# EAGLE design fusibili (EAGLE 4.14)
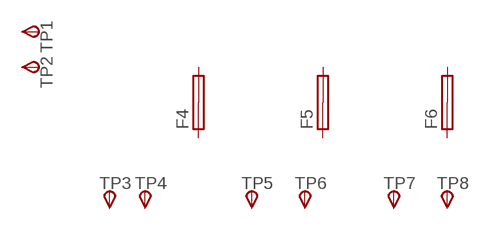
[diagram p0: schematic, sheet 1]

## Parts
F4  SHK20L  [SHK20L]
F5  SHK20L  [SHK20L]
F6  SHK20L  [SHK20L]
TP1  TPSPAD1-20Y  [P1-20Y]
TP2  TPSPAD1-20Y  [P1-20Y]
TP3  TPSPAD1-20Y  [P1-20Y]
TP4  TPSPAD1-20Y  [P1-20Y]
TP5  TPSPAD1-20Y  [P1-20Y]
TP6  TPSPAD1-20Y  [P1-20Y]
TP7  TPSPAD1-20Y  [P1-20Y]
TP8  TPSPAD1-20Y  [P1-20Y]
Unconnected: F4.1A F4.1B F4.2A F4.2B F5.1A F5.1B F5.2A F5.2B F6.1A F6.1B F6.2A F6.2B TP1.1(PP) TP2.1(PP) TP3.1(PP) TP4.1(PP) TP5.1(PP) TP6.1(PP) TP7.1(PP) TP8.1(PP)

## Library data of the parts
F4-F6 = fuse:SHK20L: FUSE HOLDER 5 x 20 mm, SH contact, SHH1 Schukat, E1073 Buerklin
TP1-TP8 = testpad:TPS: TEST PIN

## Board
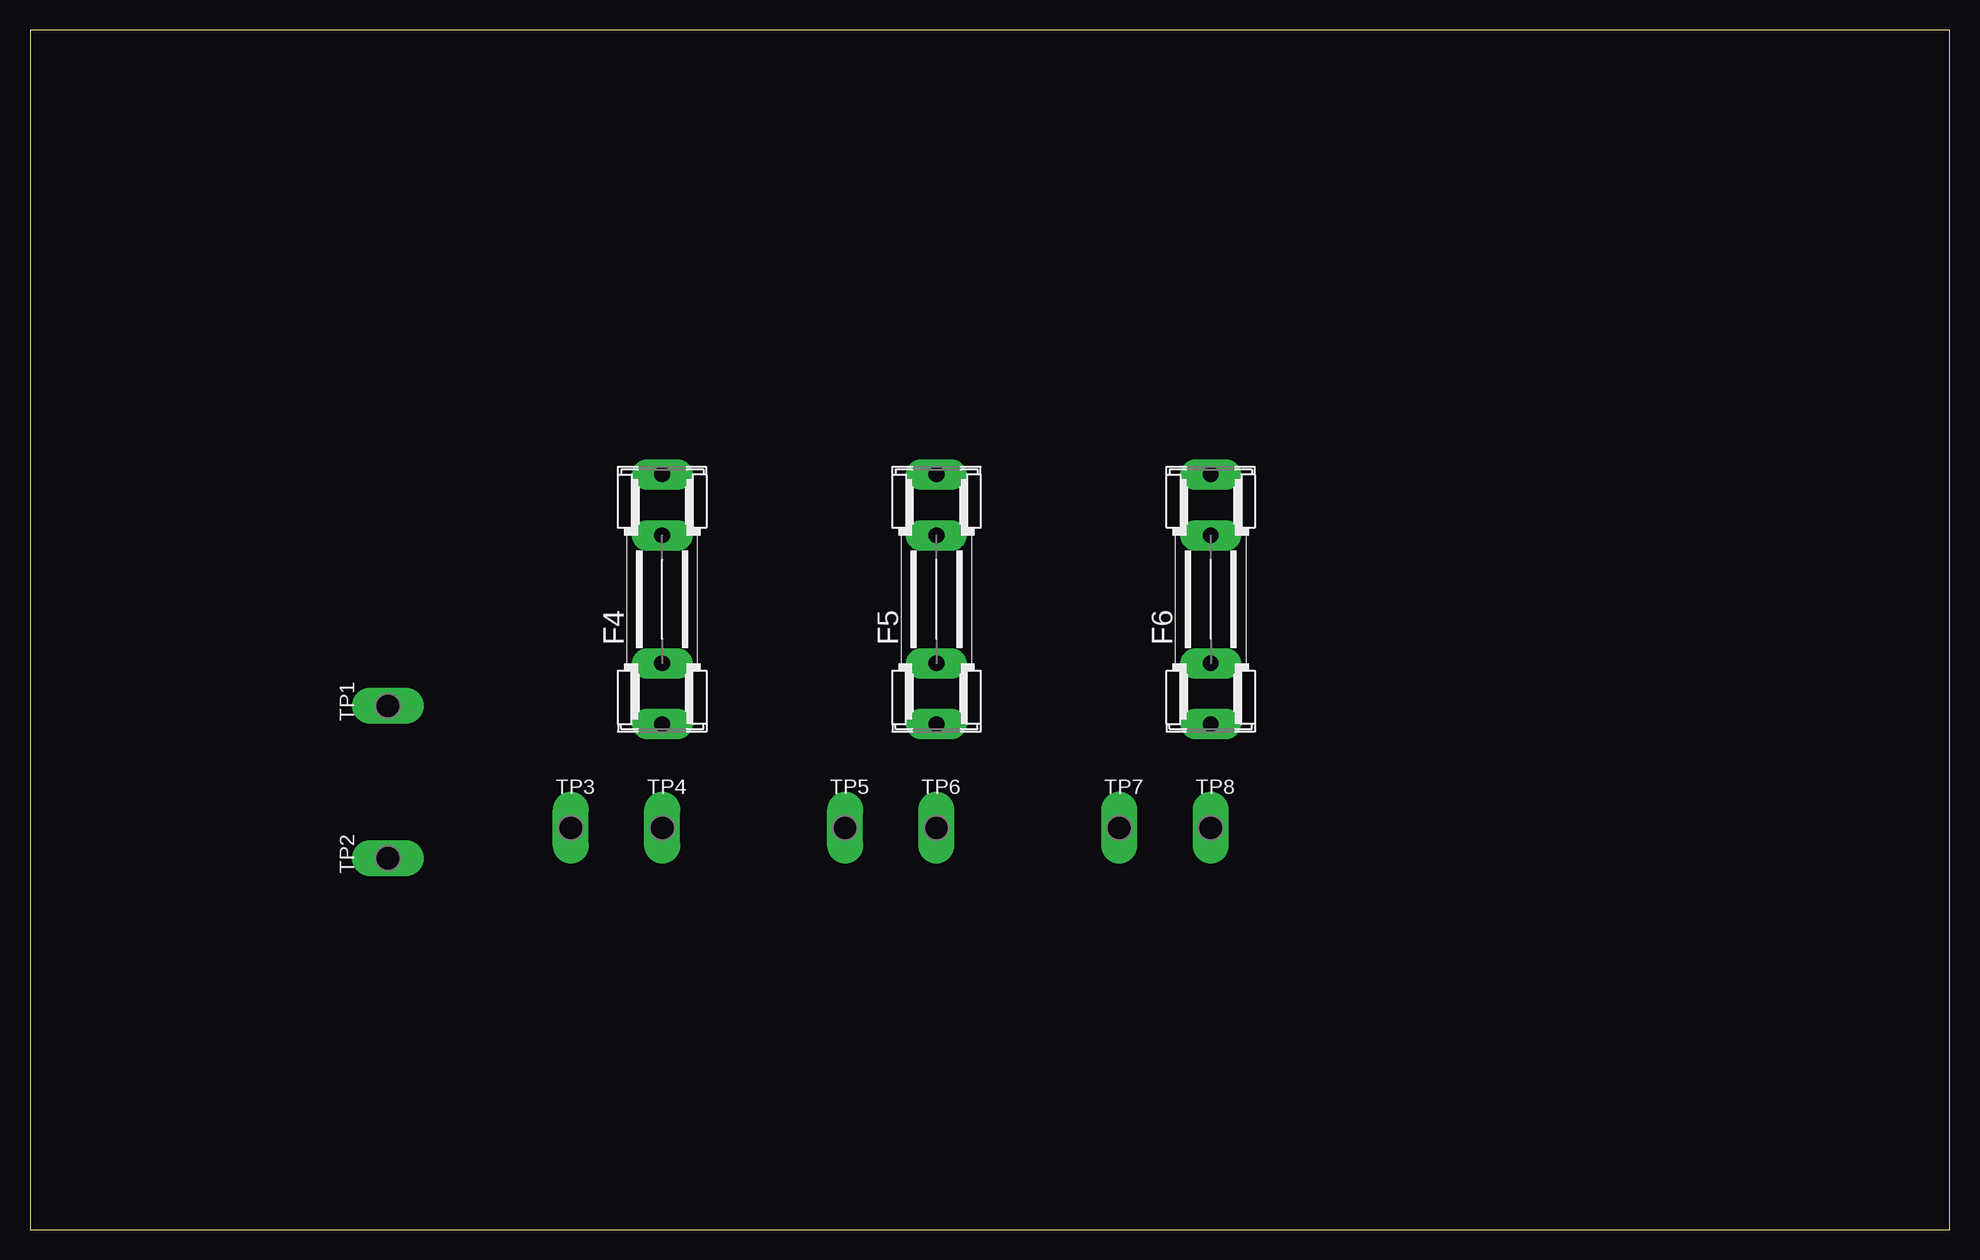
[diagram p1: board, top side]
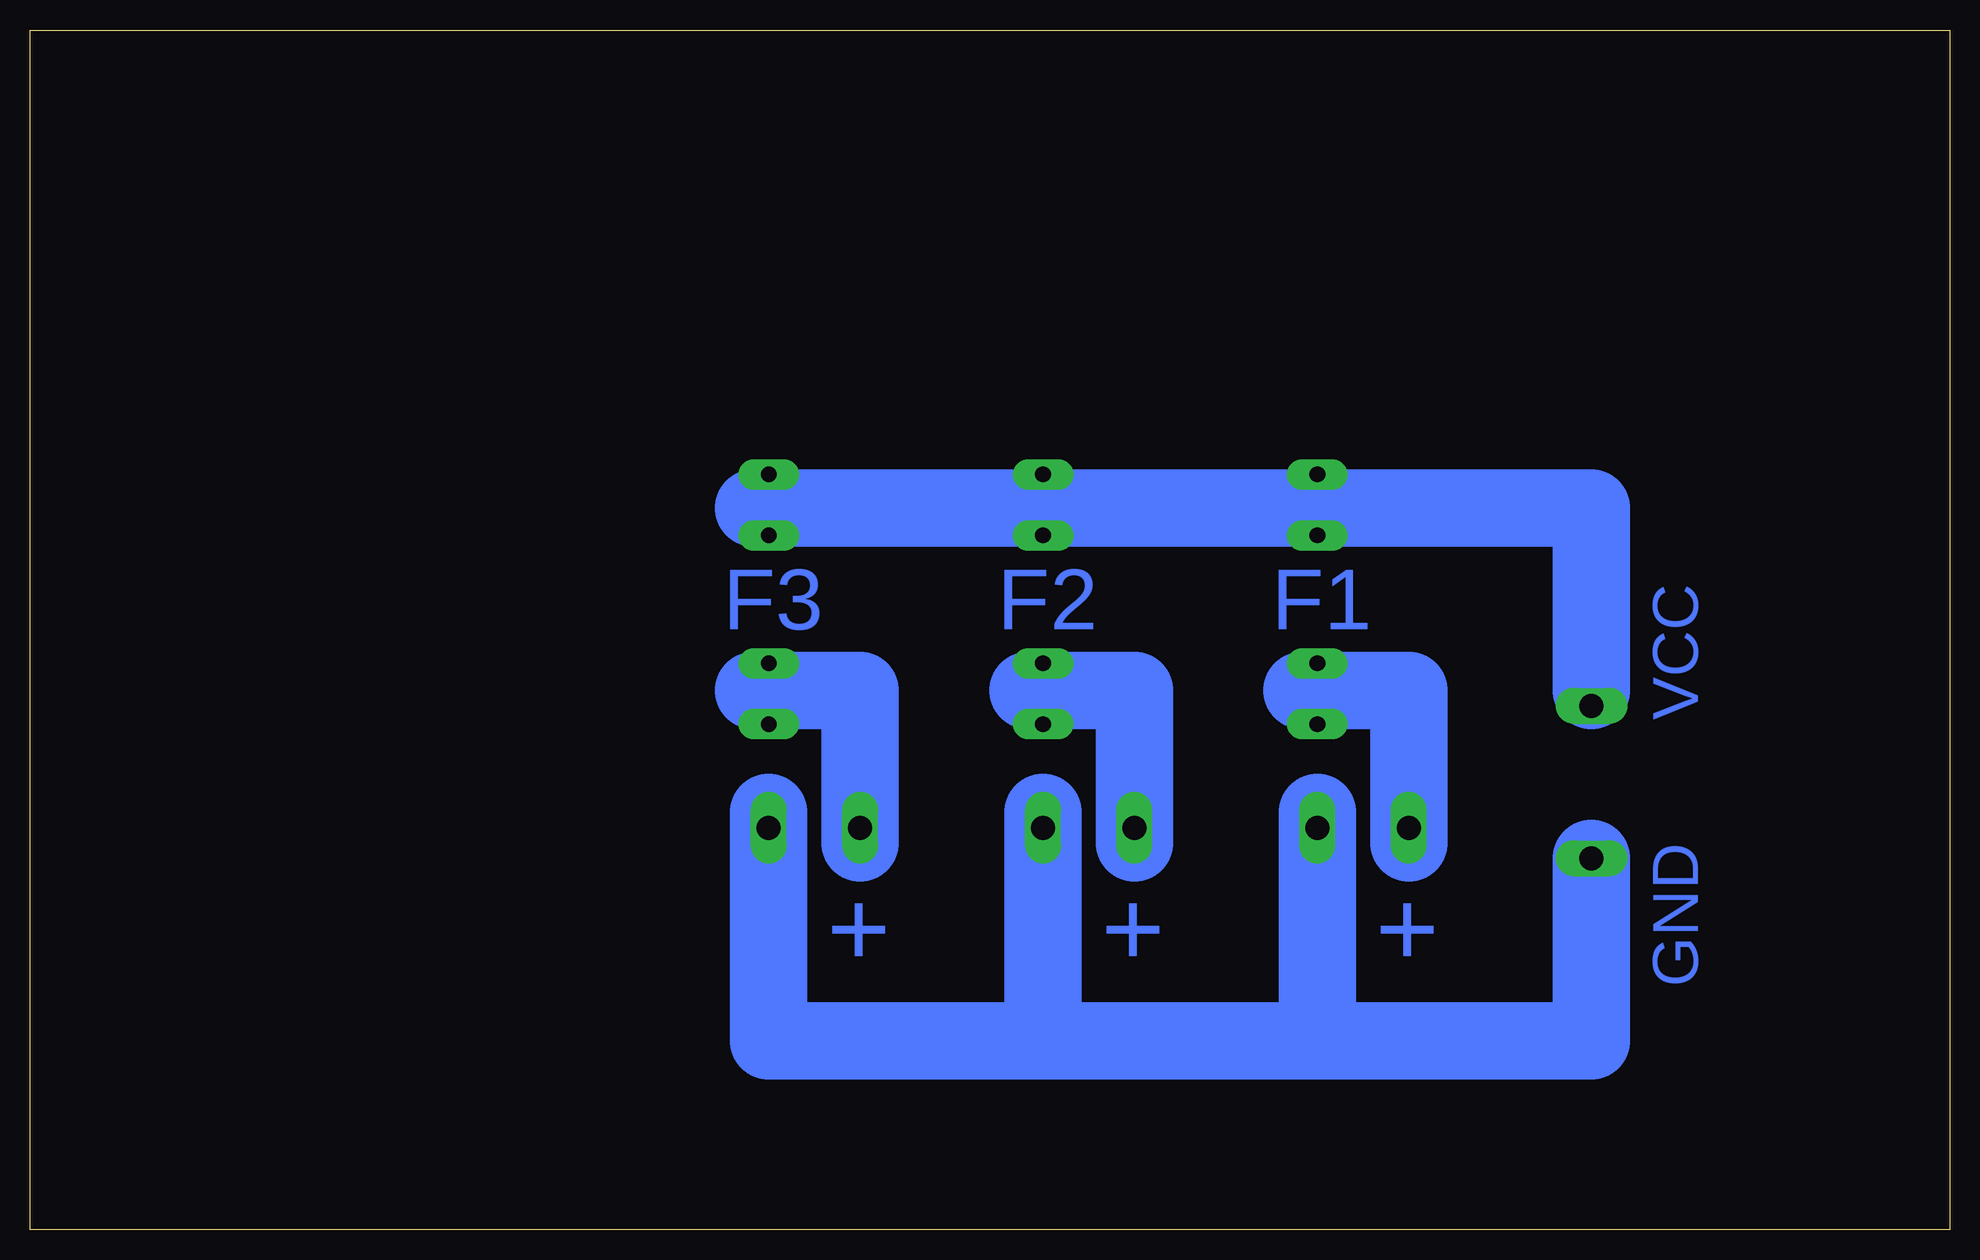
[diagram p2: board, bottom side, seen from below]

Size 160 x 100 mm. Coordinates in mm from the lower left corner, seen from the top.
Outline: 0,0 160,0 160,100 0,100 0,0
Copper layers (1*16): Top 0.035mm / dielectric 1.5mm / Bottom 0.035mm
Design rules "default": minimum track width 180mil, minimum drill 24mil, track to track 8mil, track to pad 8mil, pad to pad 8mil, via to via 8mil, smd to smd 8mil, copper to edge 40mil, drill to drill 8mil, minimum pad ring 10mil, minimum via ring 8mil, stop-mask expansion 4mil, vias tented up to drill 0mil, thermal gap 10mil

### Footprints (pad centres in the part's own frame; a part is rotated, then mirrored left to right if it is on the bottom)
SHK20L = drill 1.321 pad 2.54 long: 1A -10.414,0; 1B -5.334,0; 2A 10.414,0; 2B 5.334,0
P1-20Y = drill 2.007 pad 2.54 long: 1 0,0

### Placement (x,y rotation side)
F4  52.7,52.54 90 top
F5  75.56,52.54 90 top
F6  98.42,52.54 90 top
TP1  29.84,43.65 90 top
TP2  29.84,30.95 90 top
TP3  45.08,33.49 0 top
TP4  52.7,33.49 0 top
TP5  67.94,33.49 0 top
TP6  75.56,33.49 0 top
TP7  90.8,33.49 0 top
TP8  98.42,33.49 0 top

### Tracks (layer width: path | path; a pad name or v marks a point on that pad's centre or on a via)
N$1
  Bottom 6.452: 99.69,60.16 29.84,60.16 29.84,44.92
N$2
  Bottom 6.452: 29.84,30.95 29.84,15.71 98.42,15.71
N$3
  Bottom 6.452: 53.97,44.92 45.08,44.92 45.08,32.22
N$4
  Bottom 6.452: 76.83,44.92 67.94,44.92 67.94,32.22
N$5
  Bottom 6.452: 99.69,44.92 90.8,44.92 90.8,32.22
N$6
  Bottom 6.452: 52.7,18.25 52.7,34.76
N$7
  Bottom 6.452: 75.56,18.25 75.56,34.76
N$8
  Bottom 6.452: 98.42,15.71 98.42,34.76

### Text on the board
Bottom: VCC | F1 | F2 | F3 | GND | + | + | +